# Altium schematic sheet Mach do do am Hs1101- do nhiet do 18b20.SchDoc
size B
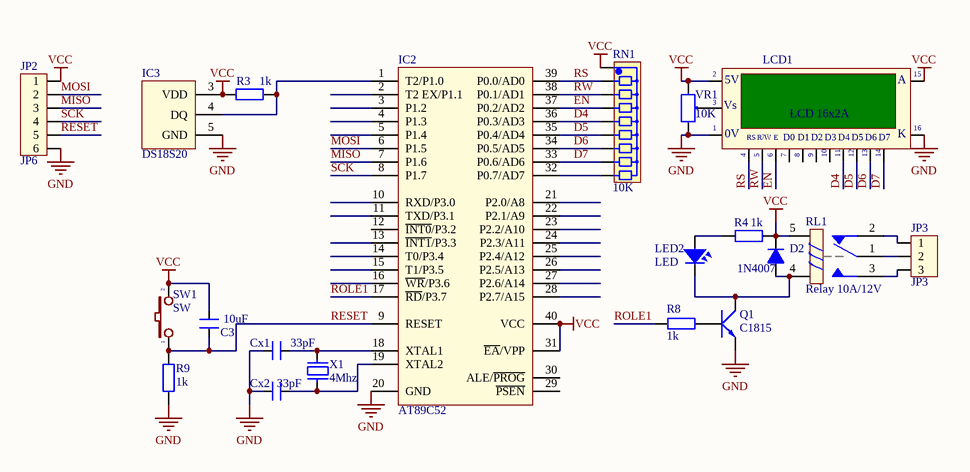
[diagram p0: Mach do do am Hs1101- do nhiet do 18b20.SchDoc]

## Parts
C3  10uF  [CN1]
Cx1  33pF  [CN1]
Cx2  33pF  [CN1]
D2  1N4007  [D1A]
IC2  AT89C52  [DIP40/W0.6]
IC3  DS18S20  [DS18S20]
JP2  JP6  [CON6]
JP3  JP3  [CON3]
LCD1  LCD 16x2A  [LCD16X2]
LED2  LED  [LED-3]
Q1  C1815  [QTO-92]
R3  1k  [R1/4W]
R4  1k  [R1/4W]
R8  1k  [R1/4W]
R9  1k  [R1/4W]
RL1  Relay 10A/12V  [RL_SPDT_10A]
RN1  10K  [RN8]
SW1  SW  [SW2]
VR1  10K  [VR]
X1  4Mhz  [XT2]

## Nets
GND: Cx1.2 Cx2.2 IC2.20(GND) IC3.5(GND) JP2.6 LCD1.1(GND) LCD1.16(K) Q1.1(E) R9.2 VR1.3
VCC: C3.1 D2.2(K) IC2.31(~{EA}/VPP) IC2.40(VCC) IC3.3(VDD) JP2.1 LCD1.2(VDD) LCD1.15(A) R3.1 R4.2 RL1.5 RN1.1 SW1.2 VR1.1
D4: IC2.36(P0.3/AD3) LCD1.11(D4) RN1.5
D5: IC2.35(P0.4/AD4) LCD1.12(D5) RN1.6
D6: IC2.34(P0.5/AD5) LCD1.13(D6) RN1.7
D7: IC2.33(P0.6/AD6) LCD1.14(D7) RN1.8
EN: IC2.37(P0.2/AD2) LCD1.6(~{EN}) RN1.4
MISO: IC2.7(P1.6) JP2.3
MOSI: IC2.6(P1.5) JP2.2
RESET: C3.2 IC2.9(RESET) JP2.5 R9.1 SW1.1
ROLE1: IC2.17(~{RD}/P3.7) R8.1
RS: IC2.39(P0.0/AD0) LCD1.4(RS) RN1.2
RW: IC2.38(P0.1/AD1) LCD1.5(R/~{W}) RN1.3
SCK: IC2.8(P1.7) JP2.4
NetCx1_1: Cx1.1 IC2.18(XTAL1) X1.2
NetCx2_1: Cx2.1 IC2.19(XTAL2) X1.1
NetD2_1: D2.1(A) LED2.2 Q1.2(C) RL1.4
NetIC2_1: IC2.1(T2/P1.0) IC3.4(DQ) R3.2
NetIC2_32: IC2.32(P0.7/AD7) RN1.9
NetJP3_1: JP3.1 RL1.2
NetJP3_2: JP3.2 RL1.1
NetJP3_3: JP3.3 RL1.3
NetLCD1_3: LCD1.3(VEE) VR1.2
NetLED2_1: LED2.1 R4.1
NetQ1_3: Q1.3(B) R8.2

Not connected (* = marked no-connect by the designer): IC2 2(T2_EX/P1.1) 3(P1.2) 4(P1.3) 5(P1.4) 10(RXD/P3.0) 11(TXD/P3.1) 12(~{INT0}/P3.2) 13(~{INT1}/P3.3) 14(T0/P3.4) 15(T1/P3.5) 16(~{WR}/P3.6) 21(P2.0/A8) 22(P2.1/A9) 23(P2.2/A10) 24(P2.3/A11) 25(P2.4/A12) 26(P2.5/A13) 27(P2.6/A14) 28(P2.7/A15) 29(~{PSEN}) 30(ALE/~{PROG}); LCD1 7(D0) 8(D1) 9(D2) 10(D3)

## Notes on the sheet
- (in symbol LCD16x2A) 5V; Vs; |; 0V; R/W; E

## Library data of the parts
C3 = CN1: Cap np  1pF - 472pF; Value: 100pF
Cx1 Cx2 = CN0: Cremic For Xtal 1pF => 100pF; Value: 33pF
D2 = D1A: Diode 1A; Value: 1N4007
IC2 = AT89C52: Atmel AT89C52, 8k Byte Flash Memory , 40 Pin; Value: AT89C52
IC3 = DS18S20: High Precision  1-Wire® Digital Thermometer
JP2 = Con6: Connector 6; Value: Connector 6
JP3 = Con3: Connector 3; Value: Connector 3
LCD1 = LCD16x2A: LCD dipslay 16 char, 2 line; Value: LCD16x2A
LED2 = LED: LED Single colour Green and Red; Value: LED 3 ly Single Colour
Q1 = C1815: NPN 600mW, ECB; Value: C1815
R3 R4 R8 R9 = R1/4W: Resistor 1/4W; Value: R1/4W - 1K
RL1 = Relay 1: Relay SPDT,10A - 12VDC 5 Pin; Value: Relay SPDT, 10A, 12V
RN1 = RN8: Resistor 8 (Thanh); Value: Tro thanh 10K
SW1 = SW2: Switch button 2 pin; Value: SW chip 2 pin
VR1 = VR: Var Resistor; Value: VR 10K
X1 = XT2: Crystal For all Crystal 2pin.; Value: 4Mhz